# EAGLE design revalarm (EAGLE 8.2.1)
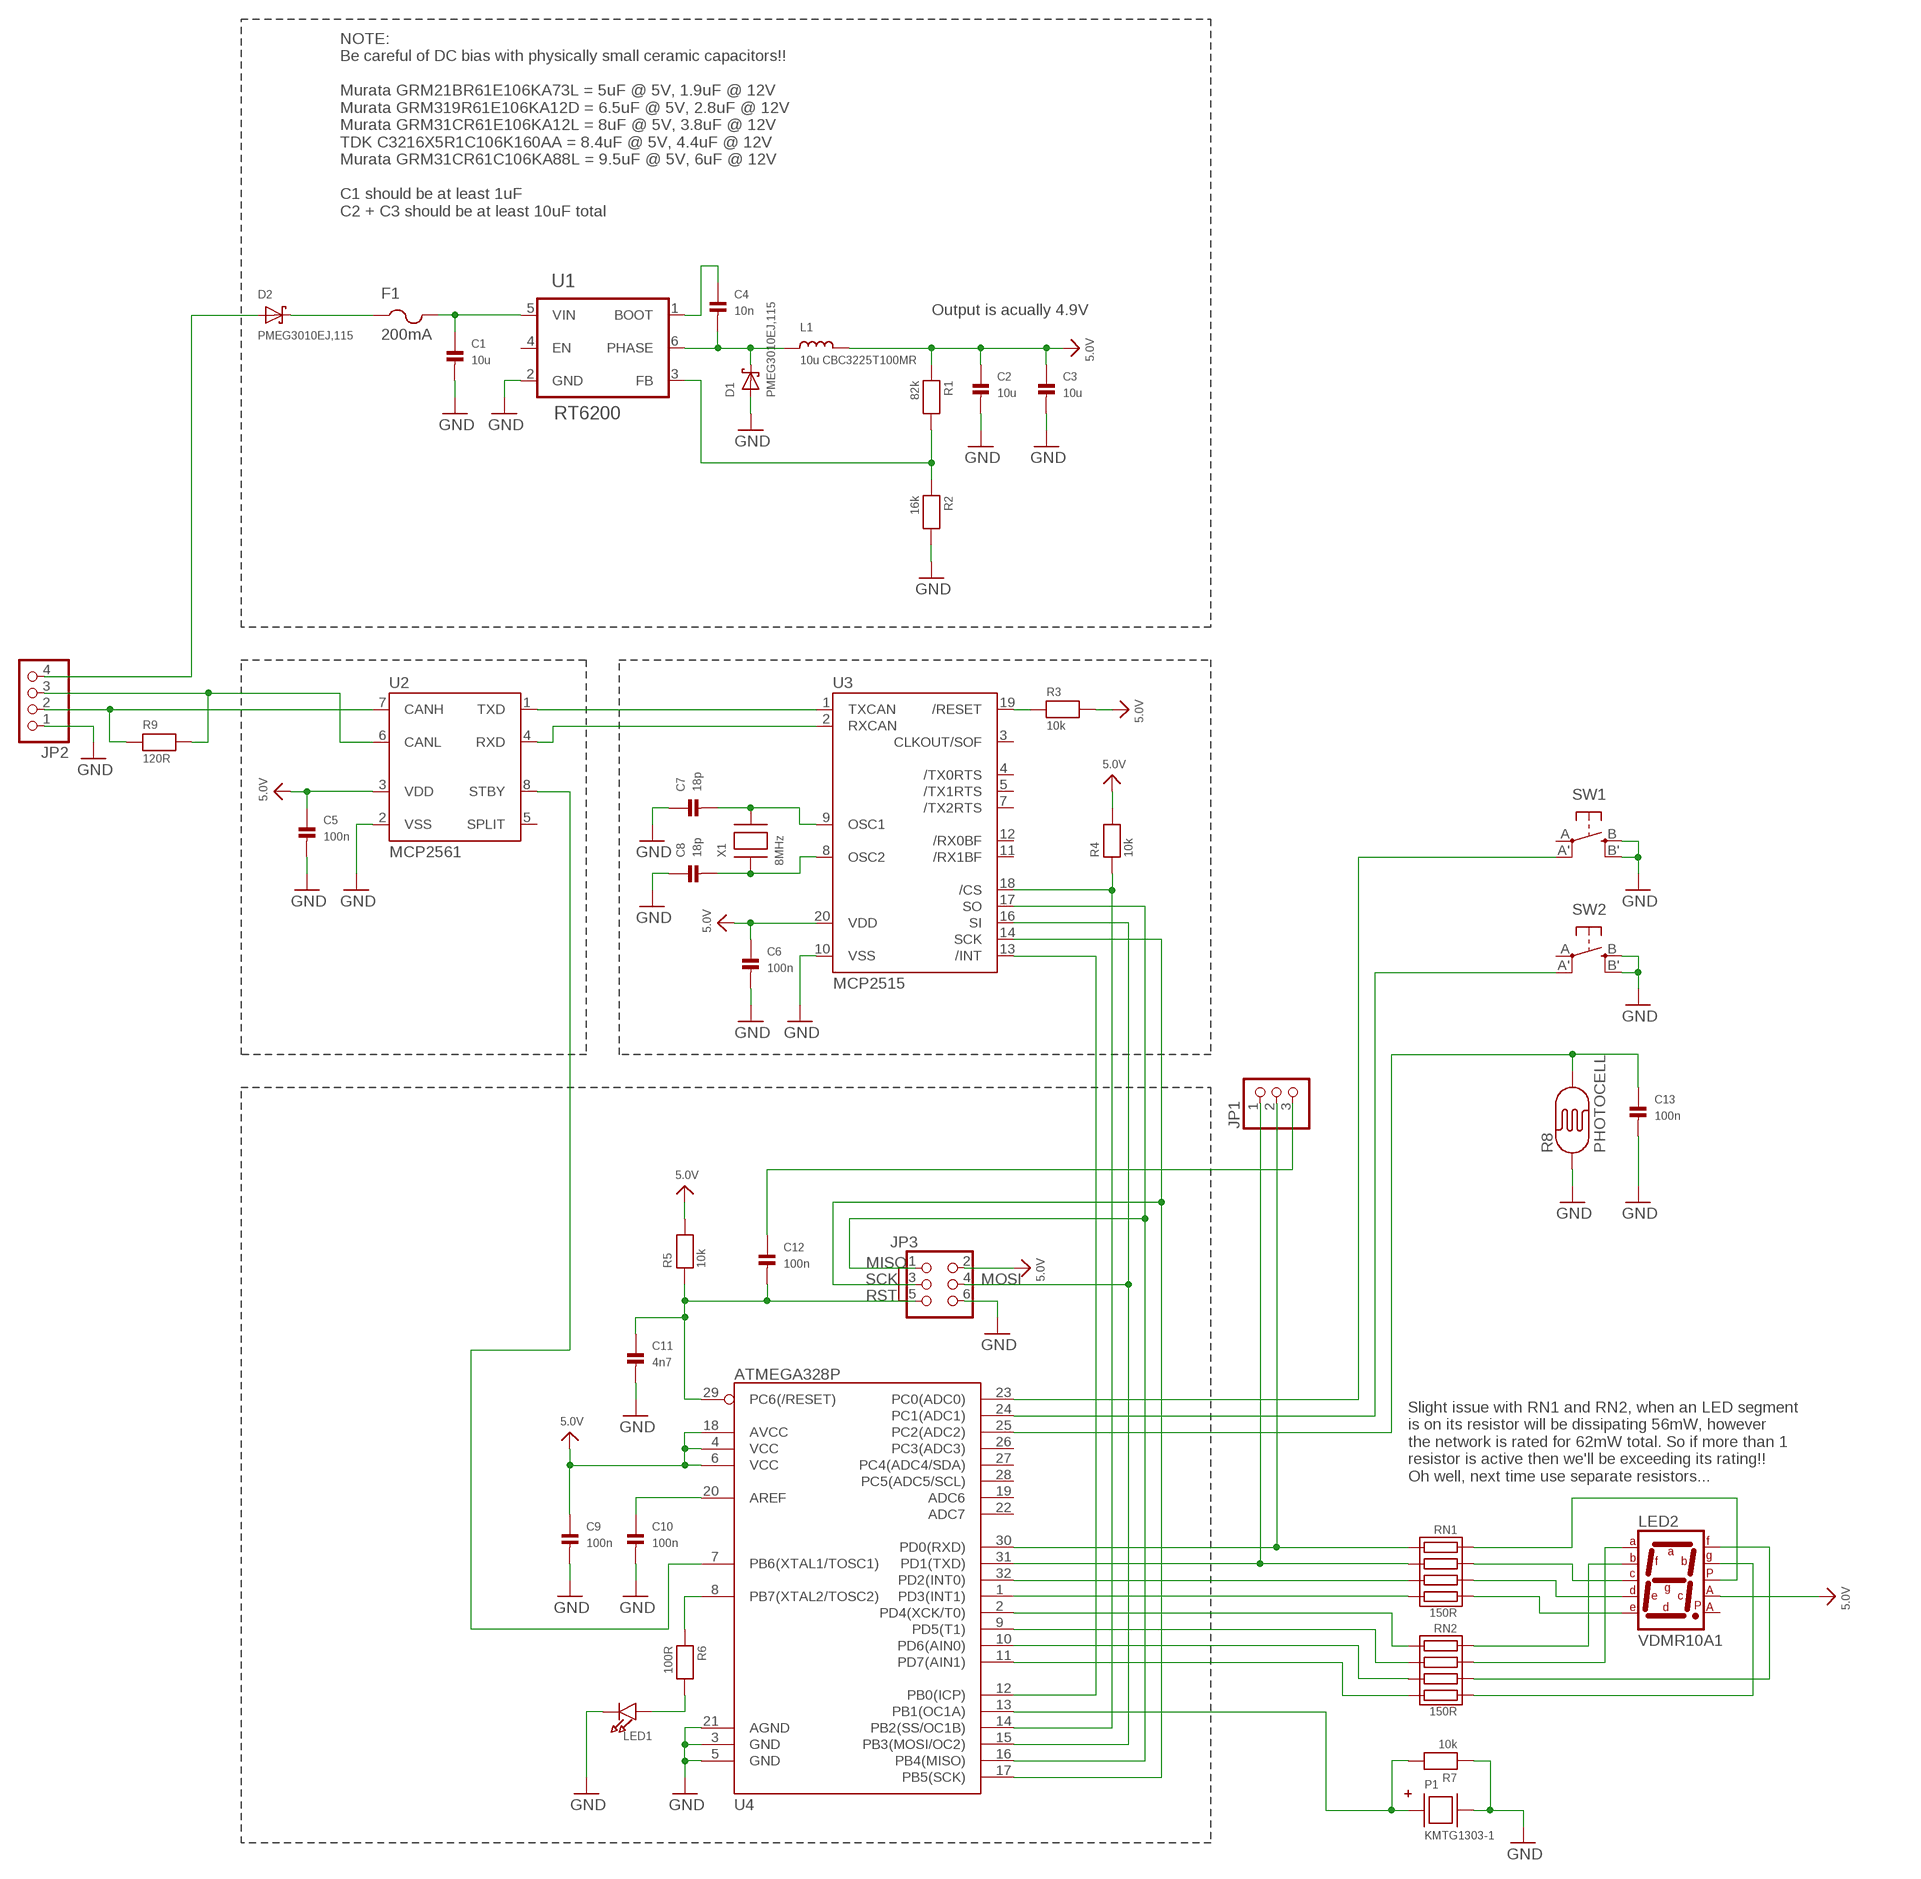
[diagram p0: schematic, sheet 1]

## Parts
C1  10u  CAP_CERAMIC1206  [1206]
C2  10u  CAP_CERAMIC1206  [1206]
C3  10u  CAP_CERAMIC1206  [1206]
C4  10n  CAP_CERAMIC0402  [0402]
C5  100n  CAP_CERAMIC0402  [0402]
C6  100n  CAP_CERAMIC0402  [0402]
C7  18p  CAP_CERAMIC0402  [0402]
C8  18p  CAP_CERAMIC0402  [0402]
C9  100n  CAP_CERAMIC0402  [0402]
C10  100n  CAP_CERAMIC0402  [0402]
C11  4n7  CAP_CERAMIC0402  [0402]
C12  100n  CAP_CERAMIC0402  [0402]
C13  100n  CAP_CERAMIC0402  [0402]
D1  PMEG3010EJ,115  DIODE-SCHOTTKYSOD-323  [SOD-323]
D2  PMEG3010EJ,115  DIODE-SCHOTTKYSOD-323  [SOD-323]
F1  200mA  PTCFUSE1206  [1206]
JP1  PINHD-1X3  [1X03]
JP2  PINHD-1X4  [1X04]
JP3  ISP6PINPOGO_PIXELRGB  [POGO60PIN_PIXELRGB]
L1  10u CBC3225T100MR  INDUCTOR1210K  [1210K]
LED1  LED0805_NOOUTLINE  [CHIPLED_0805_NOOUTLINE]
LED2  VDMR10A1  7SEGVDMR10A1  [7SEG-SMD]
P1  KMTG1303-1  PIEZOKMTG1303  [KMTG1303]
R1  82k  RESISTOR0402  [0402]
R2  16k  RESISTOR0402  [0402]
R3  10k  RESISTOR0402  [0402]
R4  10k  RESISTOR0402  [0402]
R5  10k  RESISTOR0402  [0402]
R6  100R  RESISTOR0402  [0402]
R7  10k  RESISTOR0402  [0402]
R8  PHOTOCELL  [PHOTOCELL]
R9  120R  RESISTOR1206  [1206]
RN1  150R  RESPACK_4STATIC  [RESPACK_4X0603]
RN2  150R  RESPACK_4STATIC  [RESPACK_4X0603]
SW1  SPST_TACTMC32882  [TACT_SMD4]
SW2  SPST_TACTMC32882  [TACT_SMD4]
U1  RT6200  RT6200SOT-23-6  [SOT23-6_SM_PAD]
U2  MCP2561  [SOIC8_150MIL_SMPAD]
U3  MCP2515  CANCONTROLLERTSSOP20  [TSSOP20]
U4  ATMEGA328P  ATMEGA328_SMT  [TQFP32-08]
X1  8MHz  XTALNX5032  [NX5032]

## Nets
5.0V: C2.1 C3.1 C5.1 C6.1 C9.1 JP3.2 L1.2 LED2.COMM1(CA1) R1.1 R3.2 R4.2 R5.2 U2.3(VDD) U3.20(VDD) U4.4(VCC) U4.6(VCC) U4.18(AVCC)
GND: C1.2 C2.2 C3.2 C5.2 C6.2 C7.1 C8.1 C9.2 C10.2 C11.2 C13.2 D1.A JP2.1 JP3.6 LED1.C P1.P$2(GND) R2.2 R7.1 R8.1 SW1.B'(S1) SW1.B(S) SW2.B'(S1) SW2.B(S) U1.2(GND) U2.2(VSS) U3.10(VSS) U4.3(GND) U4.5(GND) U4.21(AGND)
MISO: JP3.1 U3.17(SO) U4.16(PB4(MISO))
MOSI: JP3.4 U3.16(SI) U4.15(PB3(MOSI/OC2))
N$1: C8.2 U3.8(OSC2) X1.P$1
N$2: C13.1 R8.2 U4.25(PC2(ADC2))
N$3: U2.4(RXD) U3.2(RXCAN)
N$4: U2.1(TXD) U3.1(TXCAN)
N$5: R4.1 U3.18(/CS) U4.14(PB2(SS/OC1B))
N$6: C12.1 JP1.3
N$7: RN2.6 U4.10(PD6(AIN0))
N$8: D2.C F1.1
N$9: C7.2 U3.9(OSC1) X1.P$2
N$10: LED2.G RN2.4
N$11: JP1.2 RN1.8 U4.30(PD0(RXD))
N$12: C10.1 U4.20(AREF)
N$13: R3.1 U3.19(/RESET)
N$14: LED1.A R6.2
N$15: JP1.1 RN1.7 U4.31(PD1(TXD))
N$16: RN1.6 U4.32(PD2(INT0))
N$17: RN1.5 U4.1(PD3(INT1))
N$18: RN2.8 U4.2(PD4(XCK/T0))
N$19: RN2.7 U4.9(PD5(T1))
N$20: LED2.F RN2.3
N$21: RN2.5 U4.11(PD7(AIN1))
N$22: LED2.A RN2.2
N$23: C1.1 F1.2 U1.5(VIN)
N$24: R1.2 R2.1 U1.3(FB)
N$25: C4.1 U1.1(BOOT)
N$26: C4.2 D1.C L1.1 U1.6(PHASE)
N$27: D2.A JP2.4
N$28: JP2.2 R9.1 U2.7(CANH)
N$29: JP2.3 R9.2 U2.6(CANL)
N$30: U2.8(STBY) U4.7(PB6(XTAL1/TOSC1))
N$31: P1.P$1(VCC) R7.2 U4.13(PB1(OC1A))
N$32: LED2.B RN2.1
N$33: LED2.D RN1.3
N$34: LED2.E RN1.4
N$35: LED2.C RN1.2
N$36: LED2.DP RN1.1
N$37: U3.13(/INT) U4.12(PB0(ICP))
N$42: SW1.A'(P1) U4.23(PC0(ADC0))
N$43: SW2.A'(P1) U4.24(PC1(ADC1))
N$45: R6.1 U4.8(PB7(XTAL2/TOSC2))
RST: C11.1 C12.2 JP3.5 R5.1 U4.29(PC6(/RESET))
SCK: JP3.3 U3.14(SCK) U4.17(PB5(SCK))
Unconnected: LED2.COMM2(CA2) SW1.A(P) SW2.A(P) U1.4(EN) U2.5(SPLIT) U3.3(CLKOUT/SOF) U3.4(/TX0RTS) U3.5(/TX1RTS) U3.7(/TX2RTS) U3.11(/RX1BF) U3.12(/RX0BF) U4.19(ADC6) U4.22(ADC7) U4.26(PC3(ADC3)) U4.27(PC4(ADC4/SDA)) U4.28(PC5(ADC5/SCL))

## Notes on the sheet
- NOTE:
  Be careful of DC bias with physically small ceramic capacitors!!
  
  Murata GRM21BR61E106KA73L = 5uF @ 5V, 1.9uF @ 12V
  Murata GRM319R61E106KA12D = 6.5uF @ 5V, 2.8uF @ 12V
  Murata GRM31CR61E106KA12L = 8uF @ 5V, 3.8uF @ 12V
  TDK C3216X5R1C106K160AA = 8.4uF @ 5V, 4.4uF @ 12V
  Murata GRM31CR61C106KA88L = 9.5uF @ 5V, 6uF @ 12V
  
  C1 should be at least 1uF
  C2 + C3 should be at least 10uF total
- Output is acually 4.9V
- Slight issue with RN1 and RN2, when an LED segment
  is on its resistor will be dissipating 56mW, however
  the network is rated for 62mW total. So if more than 1
  resistor is active then we'll be exceeding its rating!!
  Oh well, next time use separate resistors...

## Library data of the parts
C1-C13 = zak:CAP_CERAMIC
D1 D2 = zak:DIODE-SCHOTTKY
F1 = zak:PTCFUSE
JP1 = pinhead:PINHD-1X3: PIN HEADER
JP2 = pinhead:PINHD-1X4: PIN HEADER
JP3 = zak:ISP6PIN
L1 = zak:INDUCTOR
LED1 = microbuilder:LED: LED 0603 - 0603 Surface Mount Package 2mA: Green LED - Low Power (3.9mcd, 2ma, 1.7Vf) - Digikey: 475-2709-2-ND Orange LED - Low Power (9.8mcd, 2ma, 1.8Vf) - Digikey: 475-1194-2-ND Red LED - Low Power (5mcd, 2ma, 1.8Vf) - Digikey: 475-1195-2-ND Yellow LED - Low Power (7mcd, 2ma, 1.8Vf) - Digikey: 475-1196-2-ND 5mA: Blue LED - Low Power (17mcd, 5ma, 2.9Vf) - Digikey: LNJ937W8CRACT-ND 0805 - 0805 Surface Mount Package 2mA: Red LED (8.8mcd, 2mA, 1.8Vf, Clear) - Low Power [Digikey: 475-2510-1-ND] Green LED (5mcd, 2mA, 1.8Vf, Clear) - Low Power [Digikey: 475-2730-1-ND] Yellow LED (11.3mcd, 2mA, 1.8Vf, Clear) - Low Power [Digikey: 475-2555-1-ND] 20mA: Red LED (104mcd, 20mA, Diffused) - LS R976 [Digikey: 475-1278-6-ND] Red LED (12mcd, 20mA, 2.0Vf, Clear) - APT2012EC [Digikey: 754-1128-1-ND] Green LED (15mcd, 20mA, 2.2Vf, Clear) - APT2012GC [Digikey: 754-1131-1-ND] Orange LED (160mcd, 20mA, 2.1Vf, Clear) - APT2012SECK [Digikey: 754-1130-1-ND] 1206 - 1206 Surface Mount Package Green LED (26mcd, 20mA, Diffused) - LG N971 [Digikey: 475-1407-6-ND] Red LED (15mcd, 20mA, Diffused) - LH N974 [Digikey: 475-1416-6-ND]
LED2 = zak:7SEG
P1 = zak:PIEZO
R1-R7 R9 = zak:RESISTOR
R8 = zak:PHOTOCELL
RN1 RN2 = zak:RESPACK_4STATIC
SW1 SW2 = zak:SPST_TACT
U1 = zak:RT6200
U2 = zak:MCP2561
U3 = zak:CANCONTROLLER
U4 = SparkFun-DigitalIC:ATMEGA328_SMT: 32-Pin Atmega328 part Commonly used on Arduino compatible boards Available in QFP and QFN packages TQFP is IC-09069 QFN is non-stock; PROD_ID: IC-09069
X1 = zak:XTAL

## Board
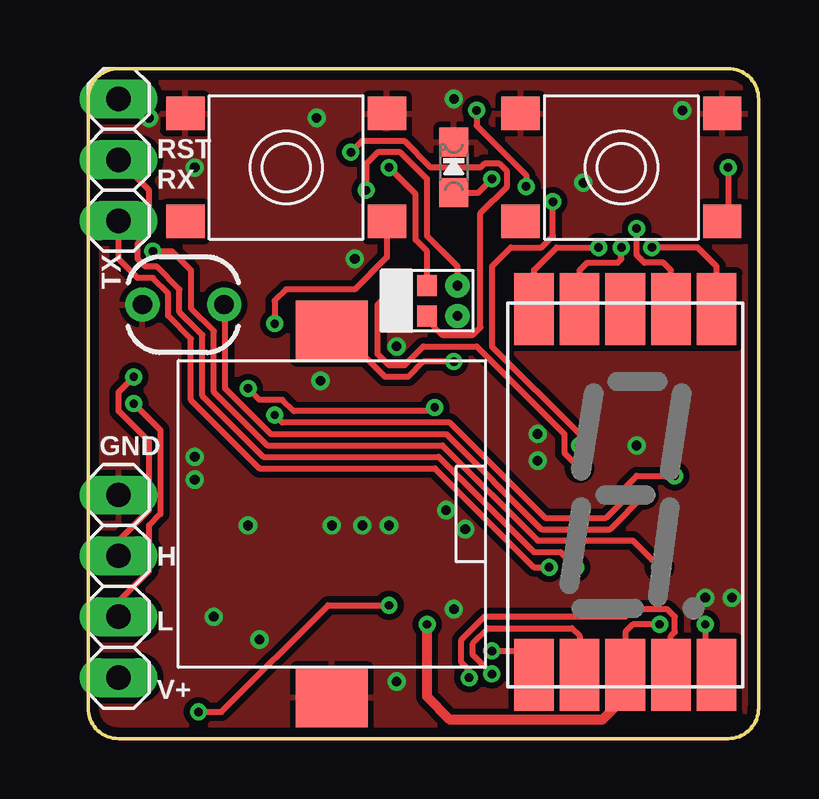
[diagram p1: board, top side]
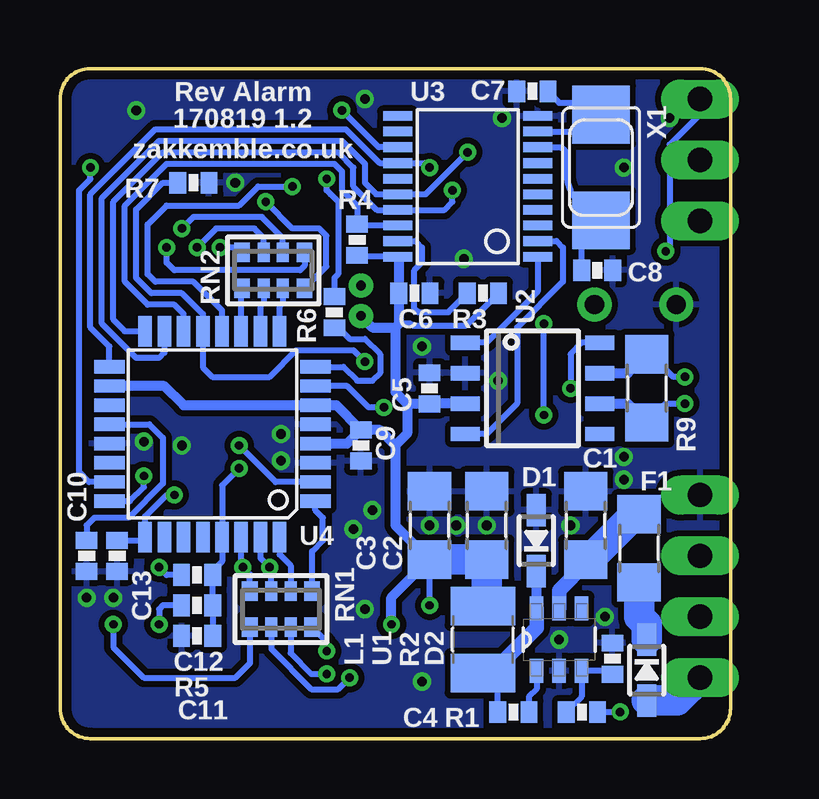
[diagram p2: board, bottom side, seen from below]

Size 27.94 x 27.94 mm. Coordinates in mm from the lower left corner, seen from the top.
Outline: 26.67,27.94 arc-90 27.94,26.67 27.94,1.27 arc-90 26.67,0 1.27,0 arc-90 0,1.27 0,26.67 arc-90 1.27,27.94 26.67,27.94
Copper layers (1*16): Top 0.0356mm / dielectric 1.5011mm / Bottom 0.0356mm
Design rules "LaenPCBOrder *": minimum track width 6mil, minimum drill 13mil, track to track 6mil, track to pad 6mil, pad to pad 6mil, via to via 6mil, smd to smd 6mil, copper to edge 15mil, drill to drill 6mil, minimum pad ring 12mil, minimum via ring 7mil, stop-mask expansion 2.5mil, vias tented up to drill 24mil, thermal gap 10mil

### Footprints (pad centres in the part's own frame; a part is rotated, then mirrored left to right if it is on the bottom)
1206 = smd 1.6 x 1.803: 1 -1.422,0; 2 1.422,0
0402 = smd 0.7 x 0.9: 1 -0.65,0; 2 0.65,0
SOD-323 = smd 1.35 x 0.8: A 1.27,0; C -1.27,0
1X03 = drill 1.016 long: 1 -2.54,0; 2 0,0; 3 2.54,0
1X04 = drill 1.016 long: 1 -3.81,0; 2 -1.27,0; 3 1.27,0; 4 3.81,0
POGO60PIN_PIXELRGB = drill 0.4: 1 -1.27,1.27; 2 0,1.27 | smd 0.889 x 0.813: 3 -1.27,0; 4 0,0; 5 -1.27,-1.27; 6 0,-1.27
1210K = smd 1.6 x 2.7: 1 -1.4,0; 2 1.4,0
CHIPLED_0805_NOOUTLINE = smd 1.2 x 1.2: A 0,-1.05; C 0,1.05
7SEG-SMD = smd 1.65 x 3: A 1.9,7.75; B 3.8,7.75; C 1.9,-7.5; COMM1 0,-7.5; COMM2 0,7.75; D -1.9,-7.5; DP 3.8,-7.5; E -3.8,-7.5; F -1.9,7.75; G -3.8,7.75
KMTG1303 = smd 2.5 x 3: P$1 -7.65,0; P$2 7.65,0
PHOTOCELL = drill 0.8 pad 1.422: 1 -1.7,0; 2 1.7,0
RESPACK_4X0603 = smd 0.65 x 0.8: 1 -1.3,-0.75; 4 1.3,-0.75; 5 1.3,0.75; 8 -1.3,0.75 | smd 0.5 x 0.8: 2 -0.4,-0.75; 3 0.4,-0.75; 6 0.4,0.75; 7 -0.4,0.75
TACT_SMD4 = smd 1.6 x 1.4: A -4.2,-2.25; A' 4.2,-2.25; B -4.2,2.25; B' 4.2,2.25
SOT23-6_SM_PAD = smd 1 x 0.56: 1 -1.295,0.94; 2 -1.295,0; 3 -1.295,-0.94; 4 1.295,-0.94; 5 1.295,0; 6 1.295,0.94
SOIC8_150MIL_SMPAD = smd 0.6 x 1.2: 1 -1.905,-2.8; 2 -0.635,-2.8; 3 0.635,-2.8; 4 1.905,-2.8; 5 1.905,2.8; 6 0.635,2.8; 7 -0.635,2.8; 8 -1.905,2.8
TSSOP20 = smd 1.2 x 0.4: 1 -2.918,2.925; 2 -2.918,2.275; 3 -2.918,1.625; 4 -2.918,0.975; 5 -2.918,0.325; 6 -2.918,-0.325; 7 -2.918,-0.975; 8 -2.918,-1.64; 9 -2.918,-2.29; 10 -2.918,-2.94; 11 2.918,-2.94; 12 2.918,-2.29; 13 2.918,-1.64; 14 2.918,-0.975; 15 2.918,-0.325; 16 2.918,0.325; 17 2.918,0.975; 18 2.918,1.625; 19 2.918,2.275; 20 2.918,2.925
TQFP32-08 = smd 1.27 x 0.559: 1 -4.293,2.8; 2 -4.293,2; 3 -4.293,1.2; 4 -4.293,0.4; 5 -4.293,-0.4; 6 -4.293,-1.2; 7 -4.293,-2; 8 -4.293,-2.8; 17 4.293,-2.8; 18 4.293,-2; 19 4.293,-1.2; 20 4.293,-0.4; 21 4.293,0.4; 22 4.293,1.2; 23 4.293,2; 24 4.293,2.8 | smd 0.559 x 1.27: 9 -2.8,-4.293; 10 -2,-4.293; 11 -1.2,-4.293; 12 -0.4,-4.293; 13 0.4,-4.293; 14 1.2,-4.293; 15 2,-4.293; 16 2.8,-4.293; 25 2.8,4.293; 26 2,4.293; 27 1.2,4.293; 28 0.4,4.293; 29 -0.4,4.293; 30 -1.2,4.293; 31 -2,4.293; 32 -2.8,4.293
NX5032 = smd 2.4 x 2.4: P$1 2.2,0; P$2 -2.2,0

### Placement (x,y rotation side)
C1  6.03,8.89 90 bottom
C2  10.16,8.89 90 bottom
C3  12.54,8.89 90 bottom
C4  9.05,1.11 180 bottom
C5  12.54,14.61 90 bottom
C6  13.18,18.57 0 bottom
C7  8.26,26.99 0 bottom
C8  5.56,19.53 180 bottom
C9  15.4,12.22 270 bottom
C10  26.83,7.62 270 bottom
C11  22.23,4.29 180 bottom
C12  22.23,6.83 0 bottom
C13  25.56,7.62 270 bottom
D1  8.1,8.26 90 bottom
D2  3.49,2.86 270 bottom
F1  3.81,7.94 90 bottom
JP1  1.27,24.13 90 top
JP2  1.27,6.35 270 top
JP3  14.13,17.62 270 top
L1  10.32,4.13 90 bottom
LED1  15.24,23.81 0 top
LED2  22.38,10.16 0 top
P1  10.16,9.37 270 top
R1  6.19,1.11 180 bottom
R2  4.92,3.33 90 bottom
R3  10.32,18.57 0 bottom
R4  15.56,20.8 270 bottom
R5  22.23,5.56 180 bottom
R6  16.51,17.78 90 bottom
R7  22.38,23.18 180 bottom
R8  3.97,18.1 0 top
R9  3.49,14.61 270 bottom
RN1  18.73,5.4 0 bottom
RN2  19.05,19.53 180 bottom
SW1  22.23,23.81 0 top
SW2  8.26,23.81 0 top
U1  7.14,4.13 90 bottom
U2  8.26,14.61 270 bottom
U3  10.95,23.02 180 bottom
U4  21.59,12.7 180 bottom
X1  5.4,23.81 270 bottom

### Tracks (layer width: path | path; a pad name or v marks a point on that pad's centre or on a via)
5.0V  (via drill 0.35)
  Top 0.254: v4.6,1.11 5.56,1.11 10,5.56 v12.54,5.56 | v23.81,4.76 22.7,4.76 22.38,4.45 LED2.COMM1
  Top 0.406: LED2.COMM1 22.38,1.75 21.43,0.79 15.08,0.79 14.13,1.75 v14.13,4.76
  Bottom 0.254: 13.83,20.05 U3.20 15.51,20.09 R4.2 | 12.53,13.97 C5.1 12.56,13.97 | R1.1 v4.6,1.11 | v12.54,5.56 C3.1 | 13.83,17.29 13.81,17.3 13.34,17.3 13.26,17.22 11.02,17.22 R3.2 | R5.2 23.65,5.56 23.81,5.4 v23.81,4.76
  Bottom 0.406: 13.83,20.05 C6.1 13.83,17.29 13.97,17.14 | U2.3 12.53,13.97 | U4.18 23.59,14.7 22.79,13.9 U4.6 16.43,13.9 C9.1 | U4.4 15.97,12.3 C9.1 | C3.1 | C3.1 13.97,8.89 13.97,12.22 | C9.1 15.38,12.86 14.61,12.86 13.97,12.22 | 12.56,13.96 C5.1 13.48,13.96 | 13.97,17.14 13.97,14.45 13.48,13.96 | 13.48,13.96 13.48,12.71 13.97,12.22 | JP3.2 14.92,17.14 13.97,17.14 | v14.13,4.76 14.13,5.89 C3.1
  Bottom 1.27: C3.1 C2.1 10.16,5.69 L1.2
GND  (via drill 0.4)
  other vias: 5.24,5.08 4.45,10.79 7.14,4.13 4.45,11.75 12.54,8.89 12.86,16.35 9.53,25.88 18.73,12.7 18.73,11.59 14.92,9.53 11.11,20 4.45,23.81 24.45,12.38 20.64,23.18 9.68,14.92 2.54,25.88 11.43,8.89 10.16,8.89 6.67,8.89 15.72,8.73 22.86,12.22 25.72,5.87 26.83,5.87 15.24,5.4 12.86,2.38 24.77,26.19 15.24,26.67
  pour Top (isolate 0.254, rank 6): 27.94,27.94 27.94,0 0,0 0,27.94
  pour Bottom (isolate 0.254, rank 6): 27.94,0 27.94,27.94 0,27.94 0,0
MISO  (via drill 0.35)
  Top 0.254: JP3.1 15.4,19.68 14.13,20.95 14.13,23.34 13.02,24.45 12.06,24.45 11.59,23.97 v11.59,22.86
  Bottom 0.254: U4.16 25.25,16.99 25.72,17.46 25.72,22.38 23.65,24.45 16.35,24.45 15.72,23.81 15.72,23.02 14.74,22.04 U3.17 11.93,22.04 11.59,22.38 v11.59,22.86
MOSI  (via drill 0.35)
  Top 0.254: JP3.4 14.13,17.46 14.76,16.83 16.03,16.83 16.35,17.14 16.35,21.91 17.46,23.02 17.46,23.65 17.14,23.97 16.51,23.97 16.35,23.81 14.29,23.81 13.18,24.92 11.43,24.92 v10.95,24.45
  Bottom 0.254: U4.15 23.59,16.1 23.81,15.88 24.77,15.88 26.19,17.3 26.19,22.54 23.81,24.92 16.19,24.92 15.24,23.97 15.24,23.18 14.76,22.7 13.88,22.7 U3.16 12.71,22.69 v10.95,24.45
N$1
  Bottom 0.254: U3.8 7.2,24.66 arc90 6.83,24.29 6.83,23.5 arc-90 5.4,22.07 X1.P$1 6.21,20.64 C8.2
N$2  (via drill 0.35)
  Top 0.254: v23.18,10.16 21.75,8.73 18.89,8.73 14.92,12.7 7.62,12.7 5.71,14.61 5.71,18.05 R8.2
  Bottom 0.254: v23.18,10.16 23.5,10.16 24.39,9.27 U4.25 24.53,8.27 C13.1
N$3
  Bottom 0.254: U3.2 7.25,20.74 6.99,20.48 6.99,19.05 8.89,17.14 8.89,13.97 10.16,12.7 U2.4
N$4
  Bottom 0.254: U3.1 8.04,18.63 10.16,16.51 U2.1
N$5
  Bottom 0.254: U3.18 15.51,21.39 R4.1 15.56,22.23 16.19,22.86 16.19,23.65 16.51,23.97 23.5,23.97 25.24,22.23 25.24,19.05 24.29,18.1 23.18,18.1 22.79,17.71 U4.14
N$6  (via drill 0.35)
  Top 0.254: v23.81,7.14 22.7,8.26 18.73,8.26 14.76,12.22 7.46,12.22 5.24,14.45 5.24,16.99 4.29,17.94 4.29,19.53 3.49,20.32 v2.7,20.32
  Bottom 0.254: JP1.3 1.27,26.04 2.54,24.77 2.54,20.48 v2.7,20.32 | C12.1 23.5,6.83 v23.81,7.14
N$7
  Bottom 0.254: U4.10 19.59,18.03 19.45,18.17 RN2.6
N$8
  Bottom 1.27: D2.C 3.49,4.76 3.81,5.08 F1.1
N$9
  Bottom 0.254: U3.9 5.94,25.31 X1.P$2 6.05,26.51 7.14,26.51 7.61,26.97 C7.2
N$10  (via drill 0.35)
  Top 0.203: LED2.G
  Top 0.254: LED2.G 18.58,19.54 19.53,20.48 v21.27,20.48
  Bottom 0.254: RN2.4 20.55,20.48 v21.27,20.48
N$11  (via drill 0.35)
  Top 0.254: JP1.2 2.54,22.86 2.54,21.11 2.06,20.64 2.06,20 2.38,19.68 2.86,19.68 3.81,18.73 3.81,17.78 4.76,16.83 4.76,14.29 7.3,11.75 14.61,11.75 18.57,7.78 19.68,7.78 v20.32,7.14
  Bottom 0.254: U4.30 20.39,7.21 v20.32,7.14 20.03,6.86 RN1.8
N$12
  Bottom 0.254: U4.20 24.21,13.1 23.65,12.54 23.65,10.64 25.08,9.21 26.51,9.21 26.83,8.89 C10.1
N$13
  Bottom 0.254: U3.19 13.12,20.74 12.86,20.48 12.86,19.84 13.18,19.53 13.18,17.94 13.02,17.78 11.76,17.78 R3.1
N$14  (via drill 0.35)
  Top 0.254: LED1.A 16.25,22.76 v16.83,23.34
  Bottom 0.254: v16.83,23.34 16.83,22.86 16.67,22.7 16.35,22.38 16.35,19.37 16.51,19.21 R6.2
N$15  (via drill 0.35)
  Top 0.254: JP1.1 1.27,20 2.06,19.21 2.7,19.21 3.33,18.57 3.33,17.62 4.29,16.67 4.29,14.13 7.14,11.27 14.45,11.27 18.57,7.14 v19.21,7.14
  Bottom 0.254: RN1.7 19.13,7.07 v19.21,7.14 19.59,7.53 U4.31
N$16
  Bottom 0.254: RN1.6 18.33,7.22 18.79,7.68 U4.32
N$17
  Bottom 0.254: RN1.5 17.43,7.81 16.99,8.26 16.99,9.21 17.3,9.52 U4.1
N$18  (via drill 0.35)
  Top 0.254: v19.37,22.38 19.37,20.95 18.89,20.48 17.62,20.48 16.83,19.68 16.83,16.35 20.48,12.7 v20.48,12.22
  Bottom 0.254: RN2.8 16.84,19.68 16.84,20.97 17.14,21.27 18.26,21.27 v19.37,22.38 | U4.2 18.95,10.7 v20.48,12.22
N$19
  Bottom 0.254: U4.9 18.79,18.04 18.65,18.18 RN2.7
N$20  (via drill 0.35)
  Top 0.254: v22.23,20.48 22.23,20 22.07,19.84 20.8,19.84 20.48,19.53 LED2.F
  Bottom 0.254: v22.23,20.48 21.43,21.27 19.84,21.27 19.45,20.88 RN2.3
N$21
  Bottom 0.254: U4.11 20.39,18.74 RN2.5
N$22  (via drill 0.35)
  Top 0.203: LED2.A
  Top 0.254: LED2.A 24.28,19.53 23.97,19.84 23.18,19.84 22.86,20.16 v22.86,21.27
  Bottom 0.254: v22.86,21.27 22.38,21.75 19.53,21.75 18.65,20.87 RN2.2
N$23
  Bottom 0.61: C1.1 6.03,7.3 7.14,6.19 U1.5
  Bottom 1.27: 3.81,9.53 F1.2 3.98,9.36 6.03,7.3
N$24
  Bottom 0.254: R2.1 5.07,2.83 U1.3 6.2,1.75 R1.2
N$25
  Bottom 0.254: C4.1 8.4,1.76 8.08,2.08 U1.1
N$26
  Bottom 0.254: C4.2 9.7,2.45 9.97,2.73
  Bottom 0.406: D1.C 8.1,5.44 U1.6
  Bottom 0.61: U1.6 8.08,4.62 9.97,2.73 L1.1
N$27
  Bottom 1.27: D2.A 2.22,1.59 JP2.4
N$28  (via drill 0.35)
  Top 0.254: JP2.2 1.27,8.26 2.54,9.53 2.54,12.38 1.27,13.65 1.27,14.45 v1.91,15.08
  Bottom 0.254: v1.91,15.08 2.38,15.08 2.86,15.56 3.02,15.56 R9.1
  Bottom 0.406: U2.7 4.28,15.24 R9.1
N$29  (via drill 0.35)
  Top 0.254: JP2.3 1.27,5.71 2.54,6.99 2.54,8.89 3.02,9.37 3.02,12.86 v1.91,13.97
  Bottom 0.254: R9.2 2.71,13.97 v1.91,13.97
  Bottom 0.406: U2.6 4.28,13.97 R9.2
N$30  (via drill 0.35)
  Top 0.254: v14.45,13.81 14.29,13.65 8.57,13.65 8.1,14.13 7.14,14.13 v6.67,14.61
  Bottom 0.254: U2.8 6.19,16.51 6.67,16.03 v6.67,14.61 | U4.7 15.97,14.7 15.08,13.81 v14.45,13.81
N$31  (via drill 0.35)
  Top 0.254: P1.P$1 10.19,16.67 10.79,16.67 12.38,15.08 13.34,15.08 13.97,15.72 v15.24,15.72
  Bottom 0.254: v15.24,15.72 15.72,16.19 18.1,16.19 19.21,15.08 21.59,15.08 21.99,15.48 U4.13 21.99,17.7 22.86,18.57 24.13,18.57 24.77,19.21 24.77,22.07 23.65,23.18 R7.2
N$32  (via drill 0.35)
  Top 0.203: 26.19,17.92 LED2.B
  Top 0.254: 26.19,17.92 26.19,19.68 25.4,20.48 v23.5,20.48
  Bottom 0.254: RN2.1 17.75,19.71 17.94,19.53 23.18,19.53 23.5,19.84 v23.5,20.48
N$33  (via drill 0.35)
  Top 0.254: LED2.D 20.48,4.29 20.16,4.6 16.67,4.6 16.03,3.97 16.03,3.49 v16.83,2.7
  Bottom 0.254: v16.83,2.7 17.46,2.7 18.33,3.57 RN1.3
N$34  (via drill 0.35)
  Top 0.254: v16.83,3.65 18.57,3.65 18.58,3.64 LED2.E
  Bottom 0.254: v16.83,3.65 16.83,4.04 RN1.4
N$35  (via drill 0.35)
  Top 0.254: v15.88,2.54 15.88,2.86 15.56,3.17 15.56,4.13 16.51,5.08 22.38,5.08 22.7,5.4 24.13,5.4 24.45,5.08 24.45,4.45 24.28,4.28 LED2.C
  Bottom 0.254: RN1.2 19.13,3.73 17.46,2.06 16.35,2.06 v15.88,2.54
N$36  (via drill 0.35)
  Top 0.254: LED2.DP 25.72,2.67 v25.72,4.76
  Bottom 0.254: RN1.1 20.03,3.15 20.64,2.54 24.45,2.54 25.72,3.81 v25.72,4.76
N$37  (via drill 0.35)
  Top 0.254: v18.26,23.02 18.26,23.5 16.19,25.56 v16.19,26.19
  Bottom 0.254: U3.13 14.66,24.66 v16.19,26.19 | U4.12 21.19,17.86 22.38,19.05 23.97,19.05 24.29,19.37 24.29,21.43 23.5,22.23 20.48,22.23 19.68,23.02 v18.26,23.02
N$42  (via drill 0.35)
  Top 0.254: v26.67,23.81 26.67,21.81 SW1.A'
  Bottom 0.254: v26.67,23.81 26.67,23.34 27.15,22.86 27.15,11.11 26.73,10.7 U4.23
N$43  (via drill 0.35)
  Top 0.254: v7.78,13.49 8.1,13.18 15.08,13.18 19.05,9.21 21.59,9.21 22.38,10 22.38,10.48 22.86,10.95 v24.45,10.95 | v7.78,17.3 7.78,18.26 8.26,18.73 11.11,18.73 12.46,20.07 SW2.A'
  Bottom 0.254: v7.78,13.49 v7.78,17.3 | U4.24 25.02,9.9 24.45,10.48 v24.45,10.95
N$45
  Bottom 0.254: U4.8 16.14,15.5 15.56,14.92 14.92,14.92 14.61,15.24 14.61,16.03 15.24,16.67 15.88,16.67 16.34,17.13 R6.1
RST  (via drill 0.35)
  Top 0.254: JP3.5 12.06,18.1 12.06,16.03 12.54,15.56 13.18,15.56 13.97,16.35 16.19,16.35 19.84,12.7 19.84,11.91 v20.48,11.27
  Bottom 0.254: v20.48,11.27 21.19,10.56 U4.29 21.19,7.38 21.57,7 C12.2 R5.1 C11.1
SCK  (via drill 0.35)
  Top 0.254: JP3.3 14.13,20.32 13.65,20.8 13.65,22.7 v12.54,23.81
  Bottom 0.254: U4.17 25.88,16.36 26.67,17.14 26.67,22.7 23.97,25.4 16.03,25.4 14.63,23.99 U3.14 12.72,23.99 v12.54,23.81

### Text on the board
tPlace: RST | RX | TX | GND | H | L | V+
bPlace: Rev Alarm | 170819 1.2 | zakkemble.co.uk